# Altium schematic sheet 14.BUZZER.SchDoc: BUZZER
size A; SheetNumber: 14; SheetTotal: 16
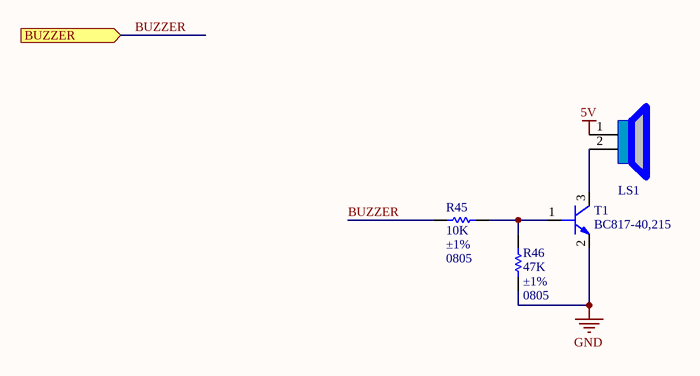
[diagram p0: 14.BUZZER.SchDoc]

## Parts
LS1  BUZZER  [BUZZER_12MM]  (value not drawn)
R45  Resistance (Ohm): 10K  Tolerance: ±1%  Package / Case: 0805  [RESC2013X65N_EIA0805]  (hidden comment: RES)
R46  Resistance (Ohm): 47K  Tolerance: ±1%  Package / Case: 0805  [RESC2013X65N_EIA0805]  (hidden comment: RES)
T1  Manufacturer Part Number: BC817-40,215  [SOT95P240X120-3N_SOT-23-3]  (hidden comment: BC817-40)

## Ports
BUZZER (in)

## Nets
5V: LS1.1(+)
GND: R46.1 T1.2(E)
BUZZER: R45.1 ; port BUZZER
NetLS1_2: LS1.2(-) T1.3(C)
NetR45_2: R45.2 R46.2 T1.1(B)

## Library data of the parts
LS1 = SAUD00001: AUDIO MAGNETIC INDICATOR 4-7V TH; Manufacturer: CUI Inc.; Manufacturer Part Number: CEM-1205C; Voltage: 5VDC; Iin: 35mA; Frequency: 2.3kHz; Cost x10 ($): 2.08200; Cost x100 ($): 1.54200; Cost x1000 ($): 1.11795; Distrubutor: Digikey; Lead Time: 13 Weeks; Cost x1 ($): 2.51000; Part Number: SAUD00001; Value: BUZZER; Size / Dimension: 12.0mm Dia x 10.0mm H; Category: Audio Products; Family: Buzzers; Type: Indicator, Internally Driven; Distributor Part Number: 102-1124-ND; ROHS: YES; Datasheet Link: http://www.digikey.com/product-detail/en/cui-inc/CEM-1205C/102-1124-ND/412383; Moisture Sensitivity Level (MSL): 1 (Unlimited); Quantity: 20; Active: Active
R45 = SRES03010098: RES SMD 10K OHM 1% 1/8W 0805; Manufacturer: Yageo; Manufacturer Part Number: RC0805FR-0710KL; Power (Watts): 0.125W, 1/8W; Cost x1 ($): 0.10; Cost x10 ($): 0.21; Cost x100 ($): 0.84; Cost x1000 ($): 3.79; Distrubutor: Digikey; Part Number: SRES03010098; Value: 10K; Category: Resistors; Family: Chip Resistor - Surface Mount; Distributor Part Number: 311-10.0KCRCT-ND; Distributor Link: http://www.digikey.com/product-detail/en/RC0805FR-0710KL/311-10.0KCRCT-ND/730482; ROHS: YES; Quantity: 0
R46 = SRES03010114: RES SMD 47K OHM 1% 1/8W 0805; Manufacturer: Yageo; Manufacturer Part Number: RC0805FR-0747KL; Power (Watts): 0.125W, 1/8W; Cost x1 ($): 0.10; Cost x10 ($): 0.21; Cost x100 ($): 0.84; Cost x1000 ($): 3.79; Distrubutor: Digikey; Part Number: SRES03010114; Value: 47K; Category: Resistors; Family: Chip Resistor - Surface Mount; Distributor Part Number: 311-47.0KCRCT-ND; Distributor Link: http://www.digikey.com/product-detail/en/RC0805FR-0747KL/311-47.0KCRCT-ND/730920; ROHS: YES; Quantity: 0
T1 = SSEM00025: TRANS NPN 45V 0.5A SOT23; Manufacturer: NXP Semiconductors; Cost x10 ($): 0.12700; Cost x100 ($): 0.06930; Cost x1000 ($): 0.02905; Distrubutor: Digikey; Lead Time: 6 Weeks; Cost x1 ($): 0.14000; Part Number: SSEM00025; Value: BC817-40; Category: Discrete Semiconductor Products; Family: Transistors - Bipolar (BJT) - Single; Package / Case: TO-236-3, SC-59, SOT-23-3; Type: NPN; Distributor Part Number: 568-1631-1-ND; ROHS: YES; Datasheet Link: http://www.digikey.com/product-detail/en/nxp-semiconductors/BC817-40,215/568-1631-1-ND/763458; Moisture Sensitivity Level (MSL): 1 (Unlimited); Part Status: Active; Quantity: 100